# Altium project PCB ZIP Socket.PrjPcb
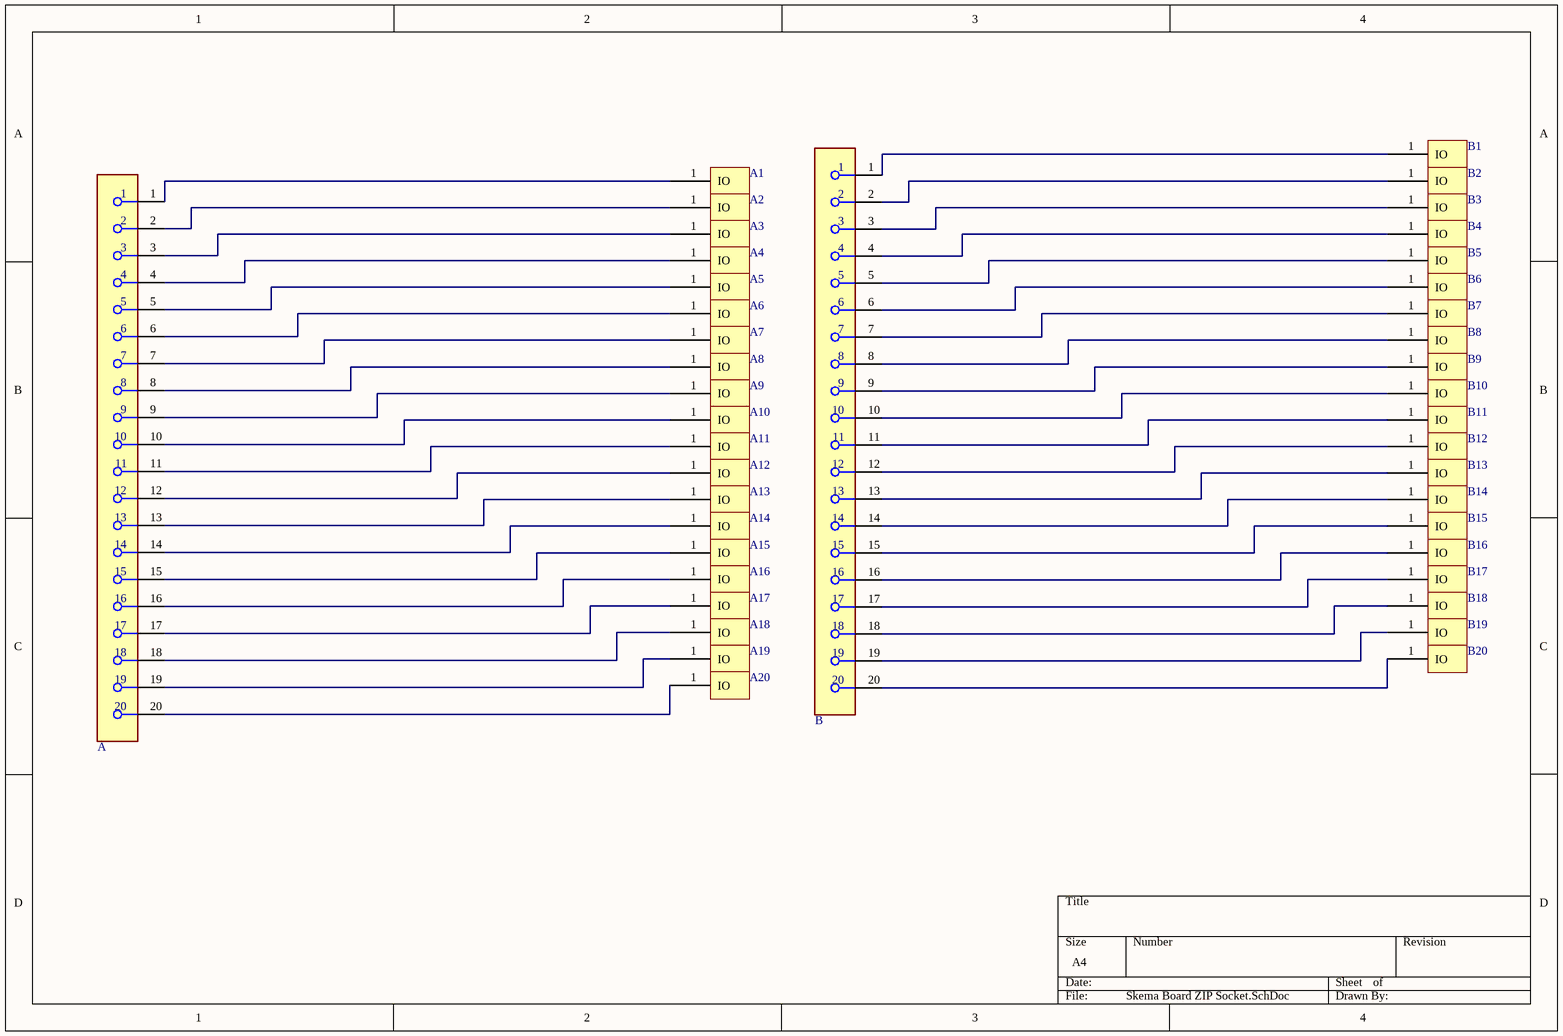
[diagram p0: Skema Board ZIP Socket.SchDoc]
1 sheet, 42 parts. Net scope: global (net labels, ports and power ports of the same name join across sheets).
Board file: Board ZIP Socket.PcbDoc

## Sheet Skema Board ZIP Socket.SchDoc
size A4

### Parts
A  220-3342-00-0602J  [3M_0_0]  (value not drawn)
A1  Female_Connector_Banana  [F_Banana]  (value not drawn)
A2  Female_Connector_Banana  [F_Banana]  (value not drawn)
A3  Female_Connector_Banana  [F_Banana]  (value not drawn)
A4  Female_Connector_Banana  [F_Banana]  (value not drawn)
A5  Female_Connector_Banana  [F_Banana]  (value not drawn)
A6  Female_Connector_Banana  [F_Banana]  (value not drawn)
A7  Female_Connector_Banana  [F_Banana]  (value not drawn)
A8  Female_Connector_Banana  [F_Banana]  (value not drawn)
A9  Female_Connector_Banana  [F_Banana]  (value not drawn)
A10  Female_Connector_Banana  [F_Banana]  (value not drawn)
A11  Female_Connector_Banana  [F_Banana]  (value not drawn)
A12  Female_Connector_Banana  [F_Banana]  (value not drawn)
A13  Female_Connector_Banana  [F_Banana]  (value not drawn)
A14  Female_Connector_Banana  [F_Banana]  (value not drawn)
A15  Female_Connector_Banana  [F_Banana]  (value not drawn)
A16  Female_Connector_Banana  [F_Banana]  (value not drawn)
A17  Female_Connector_Banana  [F_Banana]  (value not drawn)
A18  Female_Connector_Banana  [F_Banana]  (value not drawn)
A19  Female_Connector_Banana  [F_Banana]  (value not drawn)
A20  Female_Connector_Banana  [F_Banana]  (value not drawn)
B  220-3342-00-0602J  [3M_0_0]  (value not drawn)
B1  Female_Connector_Banana  [F_Banana]  (value not drawn)
B2  Female_Connector_Banana  [F_Banana]  (value not drawn)
B3  Female_Connector_Banana  [F_Banana]  (value not drawn)
B4  Female_Connector_Banana  [F_Banana]  (value not drawn)
B5  Female_Connector_Banana  [F_Banana]  (value not drawn)
B6  Female_Connector_Banana  [F_Banana]  (value not drawn)
B7  Female_Connector_Banana  [F_Banana]  (value not drawn)
B8  Female_Connector_Banana  [F_Banana]  (value not drawn)
B9  Female_Connector_Banana  [F_Banana]  (value not drawn)
B10  Female_Connector_Banana  [F_Banana]  (value not drawn)
B11  Female_Connector_Banana  [F_Banana]  (value not drawn)
B12  Female_Connector_Banana  [F_Banana]  (value not drawn)
B13  Female_Connector_Banana  [F_Banana]  (value not drawn)
B14  Female_Connector_Banana  [F_Banana]  (value not drawn)
B15  Female_Connector_Banana  [F_Banana]  (value not drawn)
B16  Female_Connector_Banana  [F_Banana]  (value not drawn)
B17  Female_Connector_Banana  [F_Banana]  (value not drawn)
B18  Female_Connector_Banana  [F_Banana]  (value not drawn)
B19  Female_Connector_Banana  [F_Banana]  (value not drawn)
B20  Female_Connector_Banana  [F_Banana]  (value not drawn)

### Nets
NetA_1: A.1 A1.1(IO)
NetA_2: A.2 A2.1(IO)
NetA_3: A.3 A3.1(IO)
NetA_4: A.4 A4.1(IO)
NetA_5: A.5 A5.1(IO)
NetA_6: A.6 A6.1(IO)
NetA_7: A.7 A7.1(IO)
NetA_8: A.8 A8.1(IO)
NetA_9: A.9 A9.1(IO)
NetA_10: A.10 A10.1(IO)
NetA_11: A.11 A11.1(IO)
NetA_12: A.12 A12.1(IO)
NetA_13: A.13 A13.1(IO)
NetA_14: A.14 A14.1(IO)
NetA_15: A.15 A15.1(IO)
NetA_16: A.16 A16.1(IO)
NetA_17: A.17 A17.1(IO)
NetA_18: A.18 A18.1(IO)
NetA_19: A.19 A19.1(IO)
NetA_20: A.20 A20.1(IO)
NetB_1: B.1 B1.1(IO)
NetB_2: B.2 B2.1(IO)
NetB_3: B.3 B3.1(IO)
NetB_4: B.4 B4.1(IO)
NetB_5: B.5 B5.1(IO)
NetB_6: B.6 B6.1(IO)
NetB_7: B.7 B7.1(IO)
NetB_8: B.8 B8.1(IO)
NetB_9: B.9 B9.1(IO)
NetB_10: B.10 B10.1(IO)
NetB_11: B.11 B11.1(IO)
NetB_12: B.12 B12.1(IO)
NetB_13: B.13 B13.1(IO)
NetB_14: B.14 B14.1(IO)
NetB_15: B.15 B15.1(IO)
NetB_16: B.16 B16.1(IO)
NetB_17: B.17 B17.1(IO)
NetB_18: B.18 B18.1(IO)
NetB_19: B.19 B19.1(IO)
NetB_20: B.20 B20.1(IO)